# Altium schematic sheet [03] - Power Supply.SchDoc: Power Supply
size A3; DrawnBy: Farogh; Organization: Farogh Iftekhar; Address1: Defence Coloney; Address2: New Delhi; Revision: V1I0; SheetNumber: 3
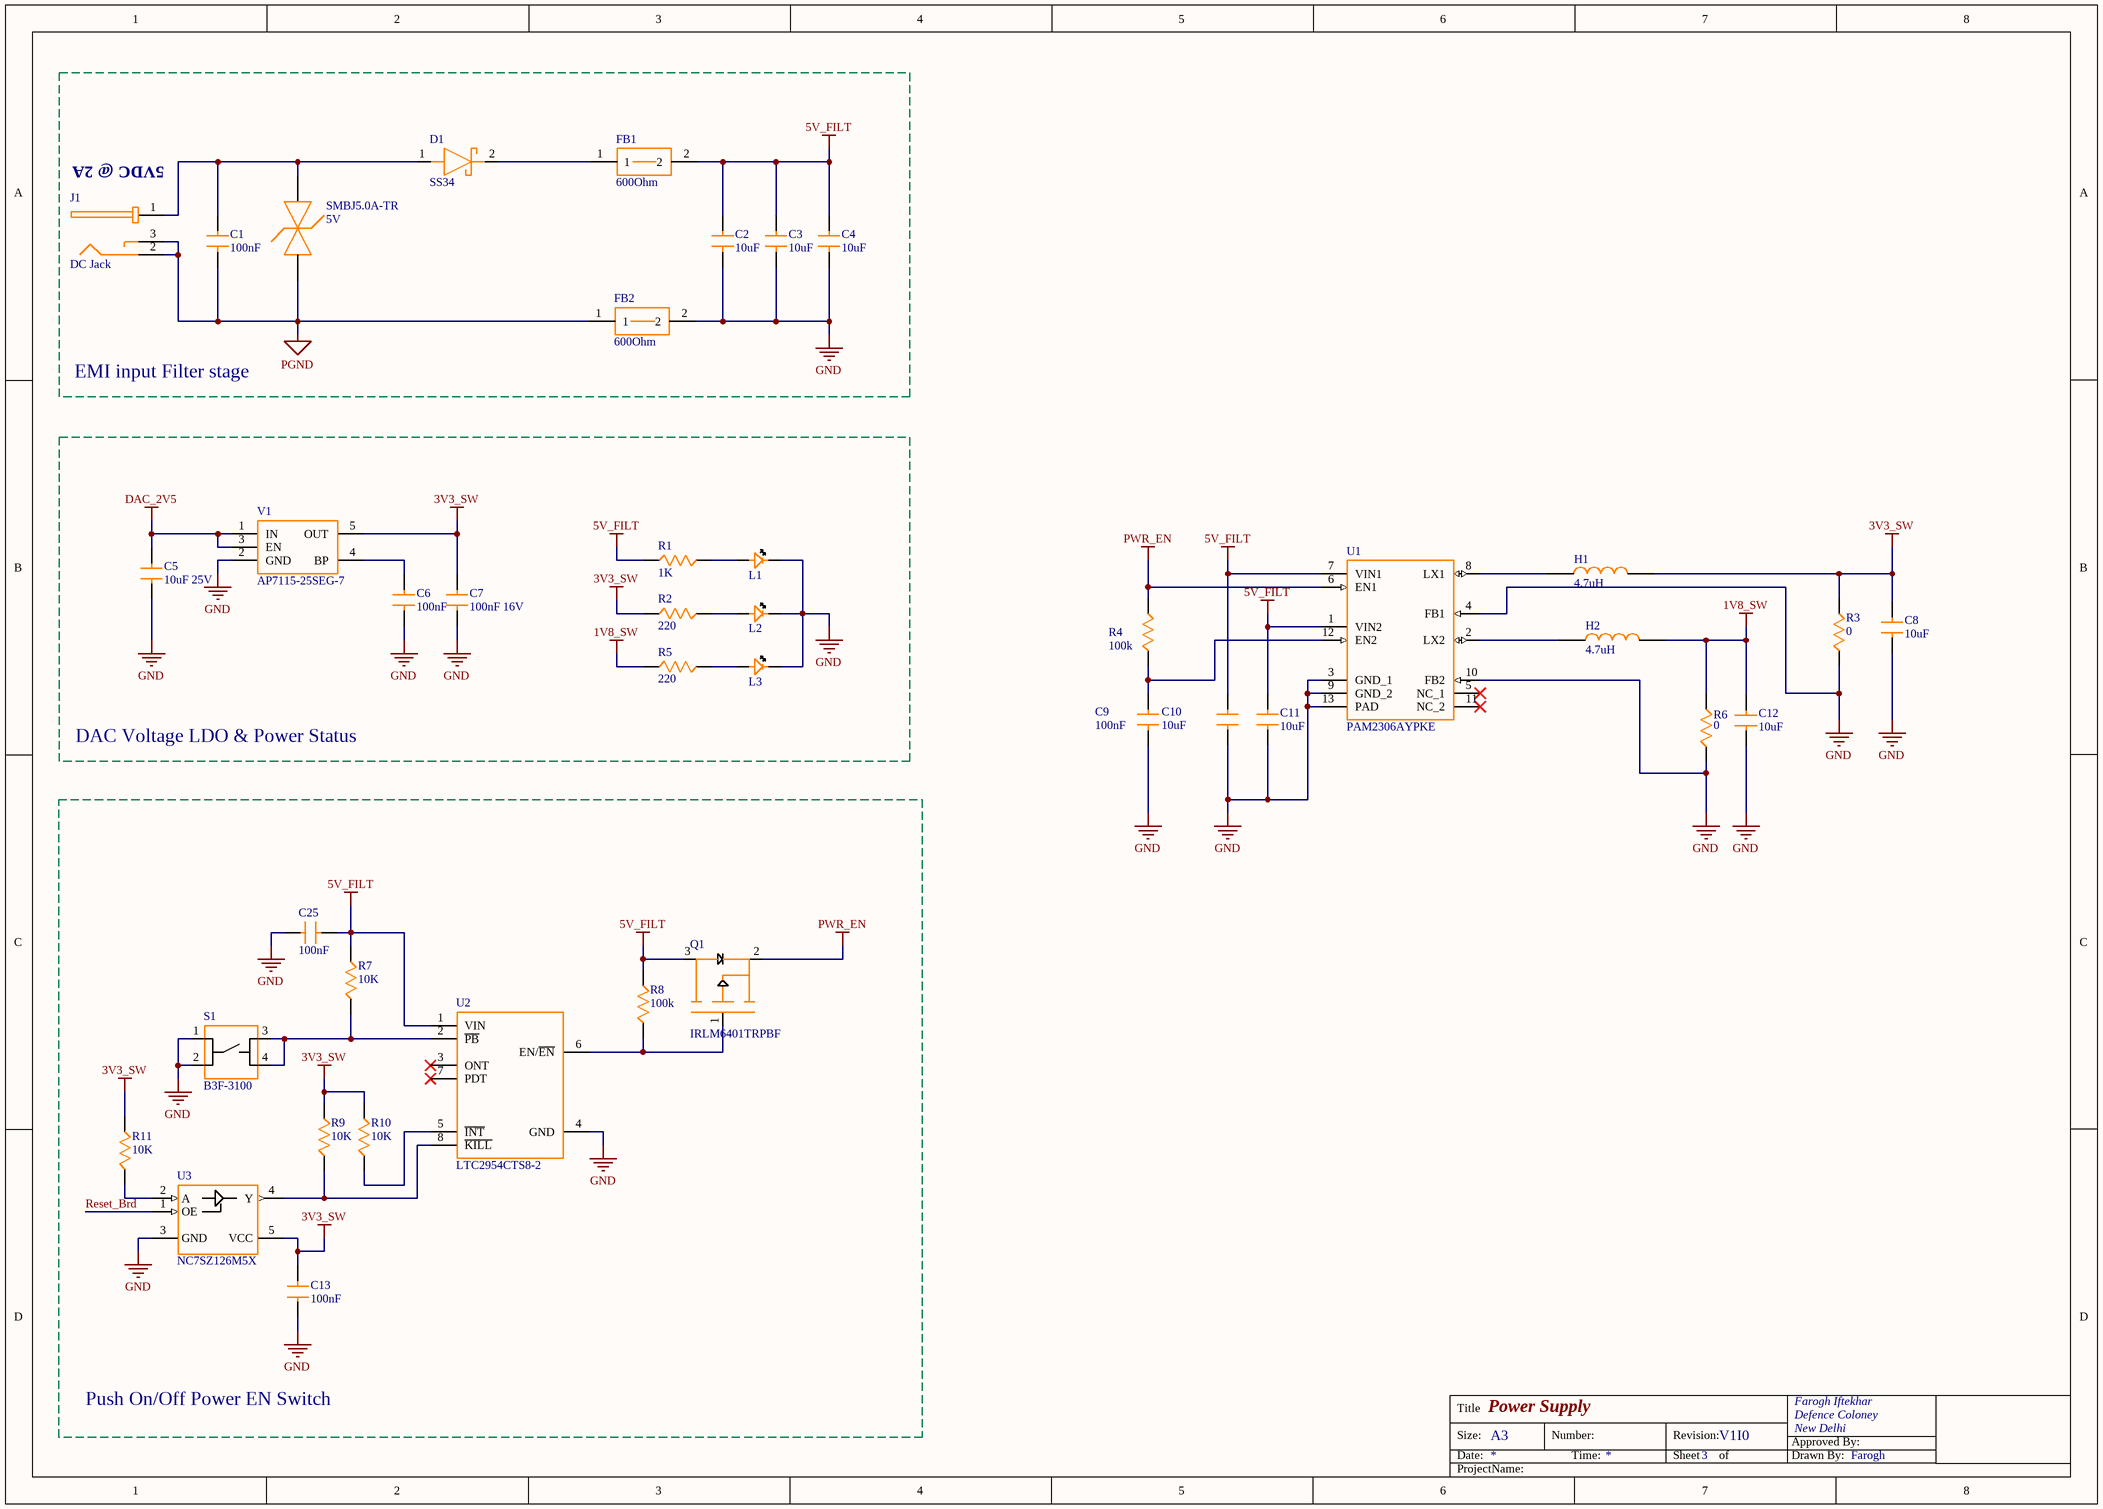
[diagram p0: [03] - Power Supply.SchDoc]

## Parts
C1  100nF  [C0805]
C2  10uF  [C1206]
C3  10uF  [C1206]
C4  10uF  [C1206]
C5  10uF 25V  [C0805]
C6  100nF  [C0805]
C7  100nF 16V  [C0805]
C8  10uF  [C0805]
C9  100nF  [C0805]
C10  10uF  [C0805]
C11  10uF  [C0805]
C12  10uF  [C0805]
C13  100nF  [C0805]
C25  100nF  [C0805]
D1  SS34  [SS34]
FB1  600Ohm  [FB_1210]
FB2  600Ohm  [FB_1210]
H1  4.7uH  [SRN4018]
H2  4.7uH  [SRN4018]
J1  DC Jack  [PJ-059BH]
L1  599-0130-007F  [LED0805]  (value not drawn)
L2  599-0130-007F  [LED0805]  (value not drawn)
L3  599-0130-007F  [LED0805]  (value not drawn)
Q1  IRLM6401TRPBF  [IRLML6401TRPBF]
R1  1K  [R0805]
R2  220  [R0805]
R3  0  [R0805]
R4  100k  [R0805]
R5  220  [R0805]
R6  0  [R0805]
R7  10K  [R0805]
R8  100k  [R0805]
R9  10K  [R0805]
R10  10K  [R0805]
R11  10K  [R0805]
S1  B3F-3100  [BSF-3100]
SMBJ5.0A-TR  5V  [SMBJ5.0A-TR]
U1  PAM2306AYPKE  [PAM2306AYPKE]
U2  LTC2954CTS8-2  [LTC2954CTS8-2]
U3  NC7SZ126M5X  [NC7SZ126M5X]
V1  AP7115-25SEG-7  [AP7115-25SEG-7]

## Blocks framed on the sheet
EMI input Filter stage: C1-C4 D1 FB1 FB2 J1 SMBJ5.0A-TR
DAC Voltage LDO & Power Status: C5-C7 L1-L3 R1 R2 R5 V1
Push On/Off Power EN Switch: C13 C25 Q1 R7-R11 S1 U2 U3

## Nets
1V8_SW: C12.2 H2.2 R5.1 R6.2
3V3_SW: C7.2 C8.2 C13.1 H1.2 R2.1 R3.2 R9.1 R10.2 R11.1 U3.5(VCC) V1.5(OUT)
5V_FILT: C2.2 C3.2 C4.2 C10.2 C11.2 C25.1 FB1.2 Q1.3(D) R1.1 R7.2 R8.2 U1.1(VIN2) U1.7(VIN1) U2.1(VIN)
DAC_2V5: C5.2 V1.1(IN) V1.3(EN)
GND: C2.1 C3.1 C4.1 C5.1 C6.1 C7.1 C8.1 C9.1 C10.1 C11.1 C12.1 C13.2 C25.2 FB2.2 L1.2 L2.2 L3.2 R3.1 R6.1 S1.1 S1.2 U1.3(GND_1) U1.4(FB1) U1.9(GND_2) U1.10(FB2) U1.13(PAD) U2.4(GND) U3.3(GND) V1.2(GND)
PGND: C1.1 FB2.1 J1.2 J1.3 SMBJ5.0A-TR.2(A)
PWR_EN: Q1.2(S) R4.2 U1.6(EN1)
Reset_Brd: U3.1(OE)
NetC1_2: C1.2 D1.1(A) J1.1 SMBJ5.0A-TR.1(K)
NetC6_2: C6.2 V1.4(BP)
NetC9_2: C9.2 R4.1 U1.12(EN2)
NetD1_2: D1.2(K) FB1.1
NetH1_1: H1.1 U1.8(LX1)
NetH2_1: H2.1 U1.2(LX2)
NetL1_1: L1.1 R1.2
NetL2_1: L2.1 R2.2
NetL3_1: L3.1 R5.2
NetQ1_1: Q1.1(G) R8.1 U2.6(EN/~{EN})
NetR7_1: R7.1 S1.3 S1.4 U2.2(~{PB})
NetR9_2: R9.2 U2.8(~{KILL}) U3.4(Y)
NetR10_1: R10.1 U2.5(~{INT})
NetR11_2: R11.2 U3.2(A)

Not connected (* = marked no-connect by the designer): U1 5(NC_1)* 11(NC_2)*; U2 3(ONT)* 7(PDT)*

## Notes on the sheet
- (near J1) 5VDC @ 2A
- Title
- Size:
- Date:
- A3
- Number:
- Time:
- Revision:
- Sheet
- of
- Approved By:
- Drawn By:
- ProjectName:

## Library data of the parts
C1 C6 C7 C9 C13 C25 = C_0805-100nF-16V: Multilayer Ceramic Capacitors MLCC - SMD/SMT 100nF 16V 20% Ceramic Capacitor; Manufacturer: Yageo; Manufacturer Part Number: CC0805MRX7R7BB104; Capacitance: 0.1 uF; Type: General Purpose and High Capacitance Surface Mount Ceramic Multilayer Capacitor; Voltage Rating DC: 16 VDC; Capacitance - pF: 100000 pF; Class: Class 2; Dielectric: X7R; Product Status: New at Mouser; Supplier 1: Mouser; Category: Multilayer Ceramic Capacitors MLCC - SMD/SMT; Stock 1: 15850; Pricing 1: 1=0.240, 10=0.114, 100=0.057, 1000=0.049, 4000=0.036, 8000=0.034, 24000=0.033, 48000=0.031, 100000=0.026 (USD); Height: 0.85 mm; Length: 2 mm; Package / Case: 0805 (2012 metric); Packaging: Cut Tape; Product: General Type MLCCs; Series: CC; Termination Style: SMD/SMT; Tolerance: 20 %; Width: 1.25 mm; Brand: Yageo; Capacitance - nF: 100 nF; Case Code - in: 0805; Case Code - mm: 2012; Maximum Operating Temperature: + 125 C; Minimum Operating Temperature: - 55 C; Product Type: Ceramic Capacitors; Standard Pack Qty: 4000; Subcategory: Capacitors; Termination: Standard; Minimum Order Quantity: 1; Reeling: True; ComponentLink1URL: https://www.mouser.com/datasheet/2/447/UPY-GPHC_X7R_6.3V-to-50V_18-1154002.pdf; ComponentLink1Description: https://www.mouser.com/datasheet/2/447/UPY-GPHC_X7R_6.3V-to-50V_18-1154002.pdf; Supplier Part Number 1: 603-CC0805MRX77BB104
C2-C4 = C_1206-10uF: Multilayer Ceramic Capacitors MLCC - SMD/SMT 10uF Y5V -20/+80% 50V; Manufacturer: Yageo; Manufacturer Part Number: CC1210ZKY5V9BB106; Tolerance: - 20 %, + 80 %; Type: MLCC Surface Mount Ceramic Capacitor; Voltage Rating DC: 50 VDC; Class: Class 2; Supplier 1: Mouser; RoHS: RoHS Compliant; Category: Multilayer Ceramic Capacitors MLCC - SMD/SMT; Stock 1: 4065; Pricing 1: 1=0.760, 10=0.524, 100=0.298, 500=0.287, 1000=0.279, 2000=0.270 (USD); Capacitance: 10 uF; Height: 1.5 mm; Length: 3.2 mm; Package / Case: 1210 (3225 metric); Packaging: Cut Tape; Product: General Type MLCCs; Series: CC; Termination Style: SMD/SMT; Width: 2.5 mm; Brand: Yageo; Case Code - in: 1210; Case Code - mm: 3225; Dielectric: Y5V; Maximum Operating Temperature: + 85 C; Minimum Operating Temperature: - 30 C; Product Type: Ceramic Capacitors; Standard Pack Qty: 2000; Subcategory: Capacitors; Termination: Standard; RoHS - Mouser: Y; Minimum Order Quantity: 1; Reeling: True; ComponentLink1URL: https://www.mouser.com/datasheet/2/447/UPY-GPHC_Y5V_6.3V-to-50V_8-1280790.pdf; ComponentLink1Description: https://www.mouser.com/datasheet/2/447/UPY-GPHC_Y5V_6.3V-to-50V_8-1280790.pdf; Supplier Part Number 1: 603-CC121ZKY5V9BB106
C5 C8 C10-C12 = C_0805-10uF: Multilayer Ceramic Capacitors MLCC - SMD/SMT 10uF 10% 25V; Manufacturer: Yageo; Manufacturer Part Number: CC0805KFX5R8BB106; Type: MLCC Surface Mount Ceramic Capacitor; Voltage Rating DC: 25 VDC; Class: Class 2; CNHTS: 8532241000; Dielectric: X5R; TARIC: 8532240000; Product Status: New Product; Supplier 1: Mouser; RoHS: RoHS Compliant; Category: Multilayer Ceramic Capacitors MLCC - SMD/SMT; Stock 1: 9112; Pricing 1: 1=0.550, 10=0.342, 100=0.175, 1000=0.158, 2500=0.110, 10000=0.106, 20000=0.103, 50000=0.096, 100000=0.089 (USD); Capacitance: 10 uF; Height: 1.25 mm; Length: 2 mm; Package / Case: 0805 (2012 metric); Packaging: Cut Tape; Product: General Type MLCCs; Series: CC; Termination Style: SMD/SMT; Tolerance: 10 %; Width: 1.25 mm; Brand: Yageo; Case Code - in: 0805; Case Code - mm: 2012; HTS Code: 8532240020; Maximum Operating Temperature: + 85 C; Minimum Operating Temperature: - 55 C; Product Type: Ceramic Capacitors; Standard Pack Qty: 10000; Subcategory: Capacitors; Termination: Standard; RoHS - Mouser: Y; Minimum Order Quantity: 1; Reeling: True; ComponentLink1URL: http://www.mouser.com/datasheet/2/447/UPY-GPHC_X5R_4V-to-50V_25-1131599.pdf; ComponentLink1Description: http://www.mouser.com/datasheet/2/447/UPY-GPHC_X5R_4V-to-50V_25-1131599.pdf; Supplier Part Number 1: 603-CC0805KFX5R8BB10
D1 = SS34: Schottky Diodes & Rectifiers 3a 40V Rectifier Schottky Barrier; Manufacturer: ON Semiconductor / Fairchild; Configuration: Single; Ifsm - Forward Surge Current: 100 A; Ir - Reverse Current: 500 uA; Vf - Forward Voltage: 0.5 V; Supplier 1: Mouser; Manufacturer Part Number: SS34; RoHS: RoHS Compliant; Category: Schottky Diodes & Rectifiers; Stock 1: 43909; Pricing 1: 1=0.610, 10=0.504, 100=0.307, 1000=0.238, 3000=0.203 (USD); Height: 2.45 mm (Max); Length: 7.15 mm (Max); Operating Temperature Range: - 55 C to + 150 C; Package / Case: SMC (DO-214AB); Packaging: Cut Tape; Product: Schottky Rectifiers; Series: SS34; Technology: Si; Type: Schottky Diode; Width: 6.25 mm (Max); Brand: ON Semiconductor / Fairchild; Mounting Style: SMD/SMT; If - Forward Current: 3 A; Maximum Operating Temperature: + 150 C; Minimum Operating Temperature: - 55 C; Product Type: Schottky Diodes & Rectifiers; Standard Pack Qty: 3000; Subcategory: Diodes & Rectifiers; Vrrm - Repetitive Reverse Voltage: 40 V; RoHS - Mouser: Y; Minimum Order Quantity: 1; Reeling: True; ComponentLink1URL: https://www.mouser.com/datasheet/2/308/SS34-1307214.pdf; ComponentLink1Description: https://www.mouser.com/datasheet/2/308/SS34-1307214.pdf; Supplier Part Number 1: 512-SS34
FB1 FB2 = FB_1210-600, 3000mA: Ferrite Beads HI CUR CHIP BD 1210 600OHMS 30%; Manufacturer: Taiyo Yuden; Manufacturer Part Number: FBMH3225HM601NT; Maximum DC Current: 3 A; Maximum DC Resistance: 42 mOhms; Type: Chip Bead Inductor for Power Lines; Test Frequency: 100 MHz; Supplier 1: Mouser; RoHS: RoHS Compliant; Category: Ferrite Beads; Stock 1: 19251; Pricing 1: 1=0.280, 10=0.178, 100=0.158, 250=0.142, 500=0.130, 1000=0.100, 2000=0.097, 5000=0.093, 10000=0.090 (USD); Capacitance: -; Height: 2.5 mm; Impedance: 600 Ohms; Length: 3.2 mm; Operating Temperature Range: - 40 C to + 125 C; Package / Case: 1210 (3225 metric); Packaging: Cut Tape; Product: Ferrite Chip Beads; Series: FB; Termination Style: SMD/SMT; Tolerance: 30 %; Width: 2.5 mm; Brand: Taiyo Yuden; Maximum Operating Temperature: + 125 C; Minimum Operating Temperature: - 40 C; Product Type: Ferrite Beads; Standard Pack Qty: 1000; Subcategory: Ferrites; RoHS - Mouser: Y; Minimum Order Quantity: 1; Reeling: True; ComponentLink1URL: https://www.mouser.com/datasheet/2/396/TaiyoYuden_chipbeads01_e-1274227.pdf; ComponentLink1Description: https://www.mouser.com/datasheet/2/396/TaiyoYuden_chipbeads01_e-1274227.pdf; Supplier Part Number 1: 963-FBMH3225HM601NT
H1 H2 = SRN4018-4R7M: Fixed Inductors 4.7uH 20% SMD 4018; Manufacturer: Bourns; Core Material: Ferrite; Maximum DC Current: 1.9 A; Maximum DC Resistance: 84 mOhms; Shielding: Shielded; CNHTS: 8504500000; MXHTS: 85045002; TARIC: 8504509590; Test Frequency: 100 kHz; Supplier 1: Mouser; Manufacturer Part Number: SRN4018-4R7M; RoHS: RoHS Compliant; Category: Fixed Inductors; Stock 1: 24604; Pricing 1: 1=0.360, 10=0.246, 100=0.224, 250=0.210, 500=0.188, 1000=0.152, 3000=0.133, 6000=0.132, 9000=0.131 (USD); Application: Power; Height: 1.8 mm; Inductance: 4.7 uH; Length: 4 mm; Packaging: Cut Tape; Product: Fixed Inductors; Series: SRN4018; Termination Style: SMD/SMT; Tolerance: 20 %; Width: 4 mm; Brand: Bourns; Mounting Style: PCB Mount; HTS Code: 8504508000; Maximum Operating Temperature: + 120 C; Minimum Operating Temperature: - 25 C; Product Type: Fixed Inductors; Standard Pack Qty: 3000; Subcategory: Inductors, Chokes & Coils; Termination: -; RoHS - Mouser: Y; Minimum Order Quantity: 1; Reeling: True; ComponentLink1URL: http://www.mouser.com/datasheet/2/54/rn4018-1391320.pdf; ComponentLink1Description: http://www.mouser.com/datasheet/2/54/rn4018-1391320.pdf; Supplier Part Number 1: 652-SRN4018-4R7M
J1 = DC-PJ-059BH: DC Power Connectors power jack, 2.5 x 5.5 mm, horizontal, through hole, high current, 1 switch; Manufacturer: CUI; Current Rating: 5 A; Inside Contact Diameter: 2.5 mm; Mounting Angle: Right Angle; Outside Contact Diameter: 5.7 mm; Voltage Rating: 24 V; Insulation Resistance: 100 MOhms; Supplier 1: Mouser; Manufacturer Part Number: PJ-059BH; RoHS: RoHS Compliant; Category: DC Power Connectors; Stock 1: 122; Pricing 1: 1=0.890, 10=0.785, 25=0.739, 50=0.708, 100=0.677, 250=0.616, 500=0.554, 1000=0.492, 2500=0.446 (USD); Color: Black; Connector Type: Jack; Contact Plating: Nickel; Housing Material: Polybutylene Terephthalate (PBT); Packaging: Tray; Product: Jacks; Termination Style: Through Hole; Brand: CUI; Contact Material: Copper; Flammability Rating: UL 94 V-0; Mounting Style: Panel; Contact Gender: Pin (Male); Maximum Operating Temperature: + 85 C; Minimum Operating Temperature: - 25 C; Product Type: DC Power Connectors; Standard Pack Qty: 280; Subcategory: Power Connectors; RoHS - Mouser: Y; Minimum Order Quantity: 1; Reeling: False; ComponentLink1URL: https://www.mouser.com/datasheet/2/670/pj-059bh-1312730.pdf; ComponentLink1Description: https://www.mouser.com/datasheet/2/670/pj-059bh-1312730.pdf
L1-L3 = 599-0130-007F: Standard LEDs - SMD SMD 0805 ORANGE; Manufacturer: Dialight; Lens Color/Style: Clear; Luminous Intensity: 95 mcd; Viewing Angle: 140 deg; CNHTS: 8541401000; If - Forward Current: 20 mA; Vf - Forward Voltage: 2.1 V; Wavelength/Color Temperature: 605 nm; Product Status: New Product; Supplier 1: Mouser; Manufacturer Part Number: 599-0130-007F; RoHS: RoHS Compliant; Category: Standard LEDs - SMD; Stock 1: 15445; Pricing 1: 1=0.450, 10=0.264, 100=0.106, 1000=0.083, 2500=0.060, 4000=0.060, 8000=0.053, 24000=0.050 (USD); Height: 0.7 mm; Illumination Color: Orange; Length: 2 mm; Orientation: Top View; Package / Case: 0805 (2012 metric); Packaging: Cut Tape; Product: Orange LEDs; Width: 1.25 mm; Brand: Dialight; Mounting Style: SMD/SMT; HTS Code: 8541402000; Maximum Operating Temperature: + 100 C; Minimum Operating Temperature: - 40 C; Product Type: LED - Standard; Standard Pack Qty: 4000; Subcategory: LEDs; RoHS - Mouser: Y; Minimum Order Quantity: 1; Reeling: True; ComponentLink1URL: http://www.mouser.com/datasheet/2/109/Dialight_CBI_data_599-0805_Apr2018-1370606.pdf; ComponentLink1Description: http://www.mouser.com/datasheet/2/109/Dialight_CBI_data_599-0805_Apr2018-1370606.pdf; Supplier Part Number 1: 645-599-0130-007F
Q1 = IRLML6401TRPBF: MOSFET MOSFT P-Ch -4.3A 50mOhm 10nC Log Lvl; Manufacturer: Infineon Technologies; Configuration: Single; Transistor Type: 1 P-Channel; Number of Channels: 1 Channel; Transistor Polarity: P-Channel; Id - Continuous Drain Current: 4.3 A; Pd - Power Dissipation: 1.3 W; Rds On - Drain-Source Resistance: 50 mOhms; Vds - Drain-Source Breakdown Voltage: 12 V; Vgs - Gate-Source Voltage: 8 V; Supplier 1: Mouser; Manufacturer Part Number: IRLML6401TRPBF; RoHS: RoHS Compliant; Category: MOSFET; Stock 1: 70377; Pricing 1: 1=0.420, 10=0.327, 100=0.178, 1000=0.133, 3000=0.115, 9000=0.108 (USD); Height: 1.1 mm; Length: 2.9 mm; Package / Case: SOT-23-3; Packaging: Cut Tape; Technology: Si; Width: 1.3 mm; Brand: Infineon Technologies; Mounting Style: SMD/SMT; Product Type: MOSFET; Qg - Gate Charge: 10 nC; Standard Pack Qty: 3000; Subcategory: MOSFETs; RoHS - Mouser: Y; Minimum Order Quantity: 1; Reeling: True; ComponentLink1URL: https://www.mouser.com/datasheet/2/196/irlml6401pbf-1228277.pdf; ComponentLink1Description: https://www.mouser.com/datasheet/2/196/irlml6401pbf-1228277.pdf; Supplier Part Number 1: 942-IRLML6401TRPBF
R1 = R_0805-1K: Thin Film Resistors - SMD 1K ohm 1% 50 ppm Thin Film; Manufacturer: Yageo; Manufacturer Part Number: RT0805FRE101KL; Power Rating: 125 mW (1/8 W); Resistance: 1 kOhms; Temperature Coefficient: 50 PPM / C; Voltage Rating: 150 V; CNHTS: 8533211000; MXHTS: 85332101; TARIC: 8533210000; Product Status: New Product; Supplier 1: Mouser; RoHS: RoHS Compliant; Category: Thin Film Resistors - SMD; Stock 1: 18694; Pricing 1: 1=0.120, 10=0.064, 100=0.023, 1000=0.016, 2500=0.011, 10000=0.010, 50000=0.009 (USD); Features: -; Height: 0.5 mm; Length: 2 mm; Package / Case: 0805 (2012 metric); Packaging: Cut Tape; Product: Precision Resistors Thin Film SMD; Series: RT; Termination Style: SMD/SMT; Tolerance: 1 %; Type: High Stability Thin Film Chip Resistor; Width: 1.25 mm; Brand: Yageo; Case Code - in: 0805; Case Code - mm: 2012; HTS Code: 8533210030; Maximum Operating Temperature: + 155 C; Minimum Operating Temperature: - 55 C; Standard Pack Qty: 10000; RoHS - Mouser: Y; Minimum Order Quantity: 1; Reeling: True; ComponentLink1URL: http://www.mouser.com/datasheet/2/447/PYu-RT_1-to-0.01_RoHS_L_9-1222720.pdf; ComponentLink1Description: http://www.mouser.com/datasheet/2/447/PYu-RT_1-to-0.01_RoHS_L_9-1222720.pdf; Supplier Part Number 1: 603-RT0805FRE101KL
R2 R5 = R_0805-220: Thin Film Resistors - SMD; Manufacturer: Yageo; Manufacturer Part Number: RT0805DRE07220RL; Power Rating: 125 mW (1/8 W); Resistance: 220 Ohms; Temperature Coefficient: 50 PPM / C; Tolerance: 0.5 %; Voltage Rating: 150 V; CNHTS: 8533211000; MXHTS: 85332101; TARIC: 8533210000; Supplier 1: Mouser; RoHS: RoHS Compliant; Category: Thin Film Resistors - SMD; Stock 1: 14351; Pricing 1: 1=0.170, 10=0.088, 100=0.031, 1000=0.022, 5000=0.015, 10000=0.014, 25000=0.013, 50000=0.012 (USD); Features: -; Height: 0.5 mm; Length: 2 mm; Operating Temperature Range: - 55 C to + 125 C; Packaging: Cut Tape; Product: Thin Film Resistors SMD; Series: RT; Technology: Thin Film; Termination Style: SMD/SMT; Type: High Precision, High Stability; Width: 1.2 mm; Brand: Yageo; Mounting Style: PCB Mount; Case Code - in: 0805; Case Code - mm: 2012; HTS Code: 8533210030; Maximum Operating Temperature: + 125 C; Minimum Operating Temperature: - 55 C; Product Type: Thin Film Resistors; Standard Pack Qty: 5000; Subcategory: Resistors; RoHS - Mouser: Y; Minimum Order Quantity: 1; Reeling: True; ComponentLink1URL: https://www.mouser.com/datasheet/2/447/PYu-RT_1-to-0.01_RoHS_L_9-1222720.pdf; ComponentLink1Description: https://www.mouser.com/datasheet/2/447/PYu-RT_1-to-0.01_RoHS_L_9-1222720.pdf; Supplier Part Number 1: 603-RT0805DRE07220RL
R3 R6 = R_0805-0: Current Sense Resistors - SMD 0 ohm Jumper 1/2W; Manufacturer: Yageo; Manufacturer Part Number: PA0805-R-470RL; Power Rating: 500 mW (1/2 W); Resistance: 0 Ohms; CNHTS: 8533211000; TARIC: 8533210000; Product Status: New Product; Supplier 1: Mouser; RoHS: RoHS Compliant; Category: Current Sense Resistors - SMD; Stock 1: 3927; Pricing 1: 1=1.30, 10=1.06, 100=0.706, 500=0.595, 1000=0.495, 5000=0.431, 10000=0.421, 25000=0.409 (USD); Application: Current Sense; Length: 2.03 mm; Packaging: Cut Tape; Product: Current Sense Chip Resistor Surface Mount; Series: PA_L; Technology: Metal Element; Termination Style: SMD/SMT; Tolerance: -; Type: Low TCR Current Sense Resistor; Width: 1.27 mm; Brand: Yageo; Mounting Style: PCB Mount; Case Code - in: 0805; Case Code - mm: 2012; HTS Code: 8533210030; Maximum Operating Temperature: + 155 C; Minimum Operating Temperature: - 55 C; Product Type: Current Sense Resistors; Standard Pack Qty: 5000; Subcategory: Resistors; Termination: 2 Terminal; RoHS - Mouser: Y; Minimum Order Quantity: 1; Reeling: True; ComponentLink1URL: http://www.mouser.com/datasheet/2/447/PYu-PA0805_L_51_RoHS_0-1480254.pdf; ComponentLink1Description: http://www.mouser.com/datasheet/2/447/PYu-PA0805_L_51_RoHS_0-1480254.pdf; Supplier Part Number 1: 603-PA0805-R-470RL
R4 R8 = R_0805-100K: Thick Film Resistors - SMD 100K ohm 1% 150V AEC-Q200; Manufacturer: Yageo; Manufacturer Part Number: AC0805FR-13100KL; Power Rating: 125 mW (1/8 W); Resistance: 100 kOhms; Temperature Coefficient: 100 PPM / C; Product Status: New Product; Supplier 1: Mouser; Category: Thick Film Resistors - SMD; Stock 1: 38013; Pricing 1: 1=0.160, 10=0.037, 100=0.013, 1000=0.010, 2500=0.006, 20000=0.005 (USD); Application: Automotive Grade; Features: -; Height: 0.5 mm; Length: 2 mm; Package / Case: 0805 (2012 metric); Packaging: Cut Tape; Product: Thick Film Resistors SMD; Series: AC; Technology: Thick Film; Termination Style: SMD/SMT; Tolerance: 1 %; Voltage Rating: 150 V; Width: 1.25 mm; Brand: Yageo; Mounting Style: PCB Mount; Case Code - in: 0805; Case Code - mm: 2012; HTS Code: 8533210030; Maximum Operating Temperature: + 155 C; Minimum Operating Temperature: - 55 C; Product Type: Thick Film Resistors; Standard Pack Qty: 20000; Subcategory: Resistors; Minimum Order Quantity: 1; Reeling: True; ComponentLink1URL: http://www.mouser.com/datasheet/2/447/PYu-AC_51_RoHS_L_6-1152827.pdf; ComponentLink1Description: http://www.mouser.com/datasheet/2/447/PYu-AC_51_RoHS_L_6-1152827.pdf; Supplier Part Number 1: 603-AC0805FR-13100KL
R7 R9-R11 = R_0805-10K: Thick Film Resistors - SMD 10K   OHM   1% 1/4W; Manufacturer: Yageo; Manufacturer Part Number: RC0805FR-7W10KL; Power Rating: 125 mW, 250 mW; Resistance: 10 kOhms; Temperature Coefficient: 100 PPM / C; Voltage Rating: 150 V; CNHTS: 8533211000; MXHTS: 85332101; TARIC: 8533210000; Supplier 1: Mouser; RoHS: RoHS Compliant; Category: Thick Film Resistors - SMD; Stock 1: 8240; Pricing 1: 1=0.190, 10=0.115, 100=0.038, 1000=0.026, 5000=0.020, 10000=0.019, 25000=0.018, 100000=0.017 (USD); Application: High Reliability; Features: -; Height: 0.5 mm; Length: 2 mm; Package / Case: 0805 (2012 metric); Packaging: Cut Tape; Product: Thick Film Resistors SMD; Series: RC; Technology: Thick Film; Termination Style: SMD/SMT; Tolerance: 1 %; Type: High Power; Width: 1.25 mm; Brand: Yageo; Mounting Style: PCB Mount; Case Code - in: 0805; Case Code - mm: 2012; HTS Code: 8533210030; Maximum Operating Temperature: + 155 C; Minimum Operating Temperature: - 55 C; Product Type: Thick Film Resistors; Standard Pack Qty: 5000; Subcategory: Resistors; RoHS - Mouser: Y; Minimum Order Quantity: 1; Reeling: True; ComponentLink1URL: http://www.mouser.com/datasheet/2/447/yageo_01152019_DESIGN_KITS_8_2012-1522572.pdf; ComponentLink1Description: http://www.mouser.com/datasheet/2/447/yageo_01152019_DESIGN_KITS_8_2012-1522572.pdf; Supplier Part Number 1: 603-RC0805FR-7W10KL
S1 = B3F-3100: Tactile Switches 3.15mm VERT 100gF; Manufacturer: Omron Electronics; Actuator: Round; Contact Form: SPST; Current Rating: 50 mA; Operating Force: 1 N; Voltage Rating DC: 24 VDC; Ground Terminal: Yes; Illuminated: Non-Illuminated; Mounting Direction: Right Angle; CNHTS: 8536500000; MXHTS: 85365099; Supplier 1: Mouser; Manufacturer Part Number: B3F-3100; RoHS: RoHS Compliant; Category: Tactile Switches; Stock 1: 5962; Pricing 1: 1=0.470, 10=0.452, 25=0.444, 50=0.427, 100=0.369, 250=0.335, 500=0.319, 1000=0.252, 2500=0.235 (USD); Color: Gray; Contact Plating: Gold; Height: 7.4 mm; Illumination Color: -; Length: 6.25 mm; Series: B3F; Stem Height: 3.15 mm; Termination Style: Solder Pin; Voltage Rating AC: -; Width: 7.3 mm; Brand: Omron Electronics; Lamp Type: -; Mounting Style: Through Hole; HTS Code: 8536509065; Maximum Operating Temperature: + 70 C; Minimum Operating Temperature: - 25 C; Product Type: Tactile Switches; Standard Pack Qty: 1000; Subcategory: Switches; RoHS - Mouser: Y; Minimum Order Quantity: 1; Reeling: False; ComponentLink1URL: http://www.mouser.com/datasheet/2/307/en-b3f-13826.pdf; ComponentLink1Description: http://www.mouser.com/datasheet/2/307/en-b3f-13826.pdf; Supplier Part Number 1: 653-B3F-3100
SMBJ5.0A-TR = SMBJ5.0A-TR: ESD Suppressors / TVS Diodes 600W 5.0V Unidirect; Manufacturer: STMicroelectronics; Breakdown Voltage: 6.4 V to 7.07 V; Clamping Voltage: 13.4 V; Polarity: Unidirectional; Supplier 1: Mouser; Manufacturer Part Number: SMBJ5.0A-TR; RoHS: RoHS Compliant; Category: ESD Suppressors / TVS Diodes; Stock 1: 38599; Pricing 1: 1=0.360, 10=0.268, 100=0.146, 1000=0.109, 2500=0.094, 10000=0.088, 25000=0.081, 50000=0.078, 100000=0.075 (USD); Package / Case: DO-214AA-2 (SMB); Packaging: Cut Tape; Series: SMBJ; Termination Style: SMD/SMT; Brand: STMicroelectronics; Maximum Operating Temperature: + 175 C; Minimum Operating Temperature: - 65 C; Pd - Power Dissipation: 600 W; Product Type: TVS Diodes; Standard Pack Qty: 2500; Subcategory: TVS Diodes / ESD Suppression Diodes; Tradename: Transil; Vesd - Voltage ESD Air Gap: -; Vesd - Voltage ESD Contact: -; Working Voltage: 5 V; RoHS - Mouser: Y; Minimum Order Quantity: 1; Reeling: True; ComponentLink1URL: https://www.mouser.com/datasheet/2/389/smbj-955195.pdf; ComponentLink1Description: https://www.mouser.com/datasheet/2/389/smbj-955195.pdf; Supplier Part Number 1: 511-SMBJ5.0A
U1 = PAM2306AYPKE: Switching Voltage Regulators Dual PWM Step-Down 40uA 1A 1.5MHz; Manufacturer: Diodes Incorporated; Input Voltage: 2.5 V to 5.5 V; Input Voltage MAX: 5.5 V; Number of Outputs: 2 Output; Output Voltage: 1.8 V, 3.3 V; Topology: Buck; Input Voltage MIN: 2.5 V; Load Regulation: 0.5 %; Supplier 1: Mouser; Manufacturer Part Number: PAM2306AYPKE; RoHS: RoHS Compliant; Category: Switching Voltage Regulators; Stock 1: 14729; Pricing 1: 1=0.700, 10=0.589, 100=0.380, 1000=0.304, 3000=0.304 (USD); Operating Temperature Range: - 40 C to + 85 C; Output Current: 1 A; Package / Case: WDFN-EP-12; Packaging: Cut Tape; Series: PAM2306; Type: PWM Step-Down DC-DC Converter; Brand: Diodes Incorporated; Mounting Style: SMD/SMT; Shutdown: Shutdown; Switching Frequency: 1.5 MHz; Maximum Operating Temperature: + 85 C; Minimum Operating Temperature: - 40 C; Operating Supply Current: 40 uA; Product Type: Switching Voltage Regulators; Standard Pack Qty: 3000; Subcategory: PMIC - Power Management ICs; Supply Voltage - Min: 2.5 V; Tradename: PAM2306; RoHS - Mouser: Y; Minimum Order Quantity: 1; Reeling: True; ComponentLink1URL: https://www.mouser.com/datasheet/2/115/PAM2306-336770.pdf; ComponentLink1Description: https://www.mouser.com/datasheet/2/115/PAM2306-336770.pdf; Supplier Part Number 1: 621-PAM2306AYPKE
U2 = LTC2954CTS8-2: Supervisory Circuits Push Button On/Off Controller with U Interrupt for Menu Driven Applications; Manufacturer: Analog Devices; Manufacturer Part Number: LTC2954CTS8-2#TRMPBF; Output Type: Open Drain; Quiescent Current: 6 uA; Battery Backup Switching: No Backup; Chip Enable Signals: Chip Enable; Development Kit: DC1090A; Number of Inputs Monitored: 1 Input; Operating Supply Current: 0.006 mA; Power Fail Detection: Yes; Reset Delay Time: 43.5 ms; Supply Voltage - Max: 26.4 V; Supply Voltage - Min: 2.7 V; Threshold Voltage: 600 mV; Watchdog Timers: No Watchdog; Product Status: New at Mouser; Supplier 1: Mouser; RoHS: RoHS Compliant; Category: Supervisory Circuits; Stock 1: 998; Pricing 1: 1=4.56, 25=3.03, 100=2.50, 250=2.37, 500=2.17, 1500=2.11 (USD); Package / Case: SOT-8; Packaging: Cut Tape; Series: LTC2954; Type: Voltage Supervisory; Brand: Analog Devices; Manual Reset: Manual Reset; Mounting Style: SMD/SMT; Maximum Operating Temperature: + 70 C; Minimum Operating Temperature: 0 C; Product Type: Supervisory Circuits; Standard Pack Qty: 500; Subcategory: PMIC - Power Management ICs; RoHS - Mouser: Y; Minimum Order Quantity: 1; Reeling: True; ComponentLink1URL: https://www.mouser.com/datasheet/2/609/2954fb-1267553.pdf; ComponentLink1Description: https://www.mouser.com/datasheet/2/609/2954fb-1267553.pdf; Supplier Part Number 1: 584-C2954CTS8-2TMPF
U3 = NC7SZ126M5X: Buffers & Line Drivers UHS Buffer; Manufacturer: ON Semiconductor / Fairchild; Function: Buffer/Line Driver; Output Type: 3-State; Quiescent Current: 2 uA; Logic Family: TinyLogic UHS; Logic Type: CMOS; Number of Channels: 1 Channel; Number of Input Lines: 1 Input; Number of Output Lines: 1 Output; High Level Output Current: - 32 mA; Input Signal Type: Single-Ended; Low Level Output Current: 32 mA; Operating Supply Voltage: 1.65 V to 5.5 V; Pd - Power Dissipation: 200 mW; Polarity: Non-Inverting; Propagation Delay Time: 5.7 ns at 3.3 V, 5 ns at 5 V; Supply Voltage - Max: 5.5 V; Supply Voltage - Min: 1.65 V; Supplier 1: Mouser; Manufacturer Part Number: NC7SZ126M5X; RoHS: RoHS Compliant; Category: Buffers & Line Drivers; Stock 1: 19641; Pricing 1: 1=0.490, 10=0.314, 100=0.135, 1000=0.104, 3000=0.079, 9000=0.070, 24000=0.066 (USD); Height: 1.3 mm (Max); Length: 3 mm (Max); Package / Case: SOT-23-5; Packaging: Cut Tape; Series: NC7SZ126; Technology: CMOS; Width: 1.7 mm (Max); Brand: ON Semiconductor / Fairchild; Mounting Style: SMD/SMT; Supply Current - Max: 2 uA; Maximum Operating Temperature: + 85 C; Minimum Operating Temperature: - 40 C; Product Type: Buffers & Line Drivers; Standard Pack Qty: 3000; Subcategory: Logic ICs; Tradename: TinyLogic; RoHS - Mouser: Y; Minimum Order Quantity: 1; Reeling: True; ComponentLink1URL: https://www.mouser.com/datasheet/2/308/NC7SZ126-1301534.pdf; ComponentLink1Description: https://www.mouser.com/datasheet/2/308/NC7SZ126-1301534.pdf; Supplier Part Number 1: 512-NC7SZ126M5X
V1 = AP7115-25SEG-7: LDO Voltage Regulators LDO SNGLE OUTPUT 150MA 220MV 2.5-5.5V; Manufacturer: Diodes Incorporated; Input Voltage MAX: 5.5 V; Number of Outputs: 1 Output; Output Type: Fixed; Output Voltage: 2.5 V; Dropout Voltage - Max: 200 mV; PSRR / Ripple Rejection - Typ: 70 dB; Voltage Regulation Accuracy: 2 %; Ib - Input Bias Current: 80 uA; Line Regulation: 0.1 %/V; Load Regulation: 0.003 %/mA; Pd - Power Dissipation: 500 mW (1/2 W); Supplier 1: Mouser; Manufacturer Part Number: AP7115-25SEG-7; RoHS: RoHS Compliant; Category: LDO Voltage Regulators; Stock 1: 7418; Pricing 1: 1=0.380, 10=0.288, 100=0.156, 1000=0.117, 3000=0.101, 9000=0.095 (USD); Height: 1.1 mm; Length: 3 mm; Operating Temperature Range: - 40 C to + 85 C; Output Current: 150 mA; Package / Case: SOT-353-5; Packaging: Cut Tape; Product: LDO Regulators; Series: AP7115; Width: 1.6 mm; Brand: Diodes Incorporated; Mounting Style: SMD/SMT; Input Voltage MIN: 2.5 V; Maximum Operating Temperature: + 85 C; Minimum Operating Temperature: - 40 C; Product Type: LDO Voltage Regulators; Standard Pack Qty: 3000; Subcategory: PMIC - Power Management ICs; RoHS - Mouser: Y; Minimum Order Quantity: 1; Reeling: True; ComponentLink1URL: https://www.mouser.com/datasheet/2/115/AP7115-69794.pdf; ComponentLink1Description: https://www.mouser.com/datasheet/2/115/AP7115-69794.pdf; Supplier Part Number 1: 621-AP7115-25SEG-7